# Altium schematic sheet 4X_22_GND_Pin_Connector.SchDoc
size A
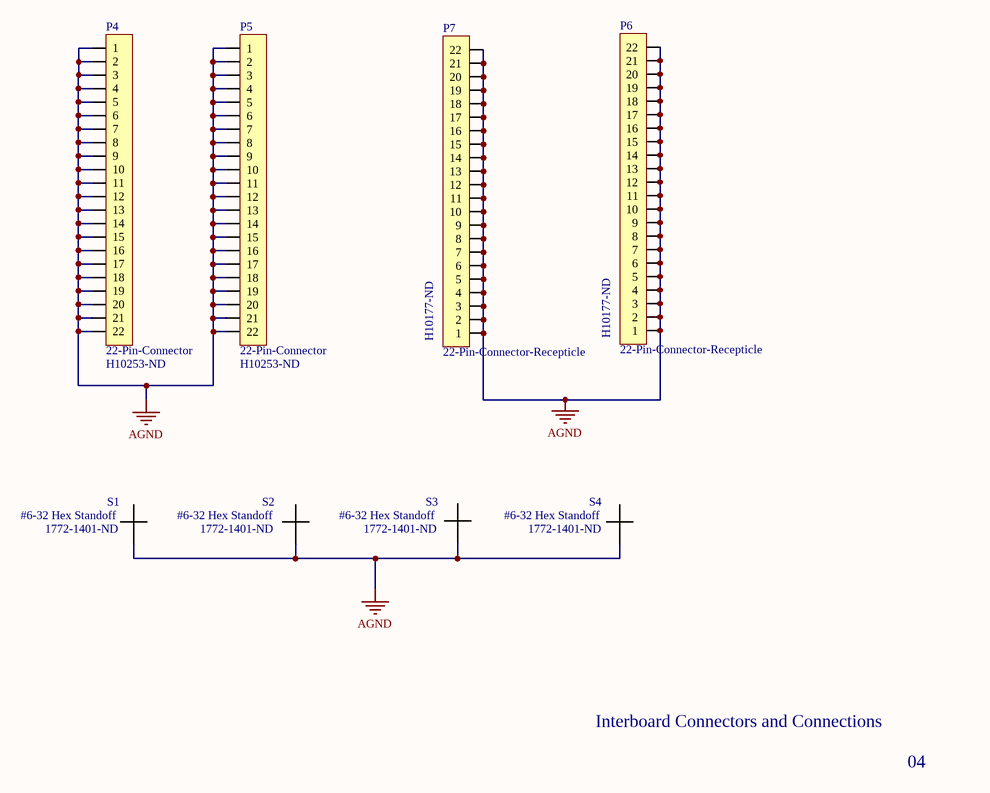
[diagram p0: 4X_22_GND_Pin_Connector.SchDoc]

## Parts
P4  22-Pin-Connector  Supplier Part Number 1: H10253-ND  [22-Pin Conenctor]
P5  22-Pin-Connector  Supplier Part Number 1: H10253-ND  [22-Pin Conenctor]
P6  22-Pin-Connector-Recepticle  Supplier Part Number 1: H10177-ND  [22 POS Connector Recepticle]
P7  22-Pin-Connector-Recepticle  Supplier Part Number 1: H10177-ND  [22 POS Connector Recepticle]
S1  #6-32 Hex Standoff  Supplier Part Number 1: 1772-1401-ND  [#6-32 GND Standoff]
S2  #6-32 Hex Standoff  Supplier Part Number 1: 1772-1401-ND  [#6-32 GND Standoff]
S3  #6-32 Hex Standoff  Supplier Part Number 1: 1772-1401-ND  [#6-32 GND Standoff]
S4  #6-32 Hex Standoff  Supplier Part Number 1: 1772-1401-ND  [#6-32 GND Standoff]

## Nets
AGND: P4.1 P4.2 P4.3 P4.4 P4.5 P4.6 P4.7 P4.8 P4.9 P4.10 P4.11 P4.12 P4.13 P4.14 P4.15 P4.16 P4.17 P4.18 P4.19 P4.20 P4.21 P4.22 P5.1 P5.2 P5.3 P5.4 P5.5 P5.6 P5.7 P5.8 P5.9 P5.10 P5.11 P5.12 P5.13 P5.14 P5.15 P5.16 P5.17 P5.18 P5.19 P5.20 P5.21 P5.22 P6.1 P6.2 P6.3 P6.4 P6.5 P6.6 P6.7 P6.8 P6.9 P6.10 P6.11 P6.12 P6.13 P6.14 P6.15 P6.16 P6.17 P6.18 P6.19 P6.20 P6.21 P6.22 P7.1 P7.2 P7.3 P7.4 P7.5 P7.6 P7.7 P7.8 P7.9 P7.10 P7.11 P7.12 P7.13 P7.14 P7.15 P7.16 P7.17 P7.18 P7.19 P7.20 P7.21 P7.22 S1.1 S2.1 S3.1 S4.1

## Notes on the sheet
- Interboard Connectors and Connections
- 04

## Library data of the parts
P4 P5 = 22-Pin-Connector: Current Therm Connector; Manufacturer: Hirose; Manufacturer Part Number: DF11-22DP-2DS(24); Number of Contacts: 22; Gender: Male; Connector Type: Male Pin; Contact Resistance: 30mR; Max Current Rating: 2A; Voltage Rating: 250V; Pitch: 2mm; Row Spacing: 0.079inch; Mount: Through Hole; Contact Plating: Tin; Contact Material: Brass,Copper Alloy,Tin; Color: Black; Housing Color: Black; Housing Material: Polyamide; Min Operating Temperature: -30°C; Max Operating Temperature: 85°C; Number of Rows: 2; Termination: Solder; Packaging: Rail/Tube; Package Quantity: 20; Fastening Type: Detent; Number of Positions: 22; Current Rating: 2A; Orientation: Right Angle; Length: 24mm; Height: 5mm; Contact Mating Length: 0.118inch; Depth: 10mm; Radiation Hardening: No; Lead Free: Lead Free; ComponentLink1URL: http://docs-usa.electrocomponents.com/techlib:/itc_doclist_US.htm?stockno=6888963&src-supplier=Allied+Electronics; ComponentLink1Description: http://docs-usa.electrocomponents.com/techlib:/itc_doclist_US.htm?stockno=6888963&src-supplier=Allied+Electronics; ComponentLink2URL: https://www.verical.com/server-webapp/html/getDatasheet?partID=456315&src-supplier=Verical; ComponentLink2Description: https://www.verical.com/server-webapp/html/getDatasheet?partID=456315&src-supplier=Verical; ComponentLink3URL: http://www.hirose.co.jp/cataloge_hp/en_DF11_20130411.pdf?src-supplier=Future+Electronics; ComponentLink3Description: http://www.hirose.co.jp/cataloge_hp/en_DF11_20130411.pdf?src-supplier=Future+Electronics; ComponentLink4URL: http://www.farnell.com/datasheets/91550.pdf?src-supplier=Element14; ComponentLink4Description: http://www.farnell.com/datasheets/91550.pdf?src-supplier=Element14; ComponentLink5URL: http://www.mouser.com/ds/2/185/DF11_catalog-1064296.pdf?src-supplier=Mouser; ComponentLink5Description: http://www.mouser.com/ds/2/185/DF11_catalog-1064296.pdf?src-supplier=Mouser; ComponentLink6URL: http://documents.rs-components.com/techlib://itc_doclist_GB.htm?stockno=6056598&src-supplier=RSComponents; ComponentLink6Description: http://documents.rs-components.com/techlib://itc_doclist_GB.htm?stockno=6056598&src-supplier=RSComponents; Supplier 1: Digi-Key; Stock 1: 3536; Pricing 1: 1=1.19, 20=1.0455, 100=0.902, 500=0.738, 1000=0.656 (USD)
P6 P7 = 22-Pin-Connector-Recepticle: Manufacturer: Hirose; Manufacturer Part Number: DF11-22DS-2DSA(05); Contact Resistance: 30mR; Mating Cycles: 30; Voltage Rating (AC): 30V; Current Rating: 2A; Number of Positions: 22; Connector Type: Receptacle; Insulation Resistance: 1GR; Pitch: 2mm; Row Spacing: 0.079inch; Supplier 1: Digi-Key; Stock 1: 843; Pricing 1: 1=1.40000, 10=1.27400, 100=1.09200, 500=0.91000, 1000=0.78000 (USD); RoHS: Yes; Mount: Through Hole; Contact Plating: Tin; Contact Material: Copper; Color: Black; Housing Color: Black; Housing Material: Polyamide; Number of Rows: 2; Contact Gender: Female; Package Quantity: 100; Packaging: Bulk; Termination: Through Hole; Gender: Receptacle; Number of Contacts: 22; Orientation: Straight; Lead Pitch: 2mm; REACH SVHC: No SVHC; Lead Free: Lead Free; Flammability Rating: UL94 V-0; ComponentLink1URL: https://datasheet.ciiva.com/11752/0900766b80d975f3-11752361.pdf?src-supplier=RSComponents; ComponentLink1Description: https://datasheet.ciiva.com/11752/0900766b80d975f3-11752361.pdf?src-supplier=RSComponents; ComponentLink2URL: https://datasheet.ciiva.com/14122/df11serie-eng-tds-14122182.pdf?src-supplier=Distrelec; ComponentLink2Description: https://datasheet.ciiva.com/14122/df11serie-eng-tds-14122182.pdf?src-supplier=Distrelec; ComponentLink3URL: https://datasheet.ciiva.com/5155/en-df11-20130411-258217-5155093.pdf?src-supplier=Mouser; ComponentLink3Description: https://datasheet.ciiva.com/5155/en-df11-20130411-258217-5155093.pdf?src-supplier=Mouser
S1-S4 = #6-32 Hex Standoff: Hex standoff for Thermistor GND Board; Manufacturer: RAF; Manufacturer Part Number: 2104-632-AL; Gender: Female to Female; System: Connector; RoHS: Yes; Case/Package: Aluminum; Material: Aluminium; Shape: Hex; Length: 0.5inch; ComponentLink1URL: https://datasheet.ciiva.com/18425/70006493-18425850.pdf?src-supplier=Allied+Electronics; ComponentLink1Description: https://datasheet.ciiva.com/18425/70006493-18425850.pdf?src-supplier=Allied+Electronics; ComponentLink2URL: https://datasheet.ciiva.com/30059/2101-1032-b-5-30059595.pdf?src-supplier=Onlinecomponents.com; ComponentLink2Description: https://datasheet.ciiva.com/30059/2101-1032-b-5-30059595.pdf?src-supplier=Onlinecomponents.com; Supplier 1: Digi-Key; Stock 1: 3884; Pricing 1: 1=0.26000, 25=0.17400, 100=0.14820, 250=0.14080, 500=0.13338, 1000=0.12597 (USD)